# Altium schematic sheet 2_Power.SCHDOC
size 297 x 209 mm; SheetNumber: 4; SheetTotal: 18; DocumentName: 2_Power.SCHDOC
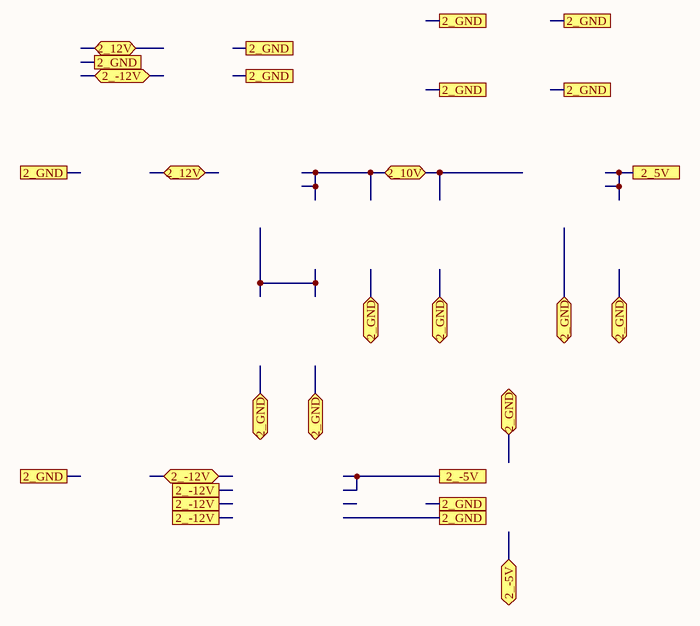
[diagram p0: 2_Power.SCHDOC]

## Ports
2_5V, 2_10V (bidir), 2_12V (bidir), 2_-5V, 2_-12V, 2_-12V (bidir), 2_GND

## Notes on the sheet
- A
- B
- C
- D
- 1
- 2
- 3
- Title
- 4
- Size
- A4
- Number
- Rev
- Date
- Filename
- Drawn by
- Sheet
- of